# EAGLE design esp32_board (EAGLE 9.6.2)
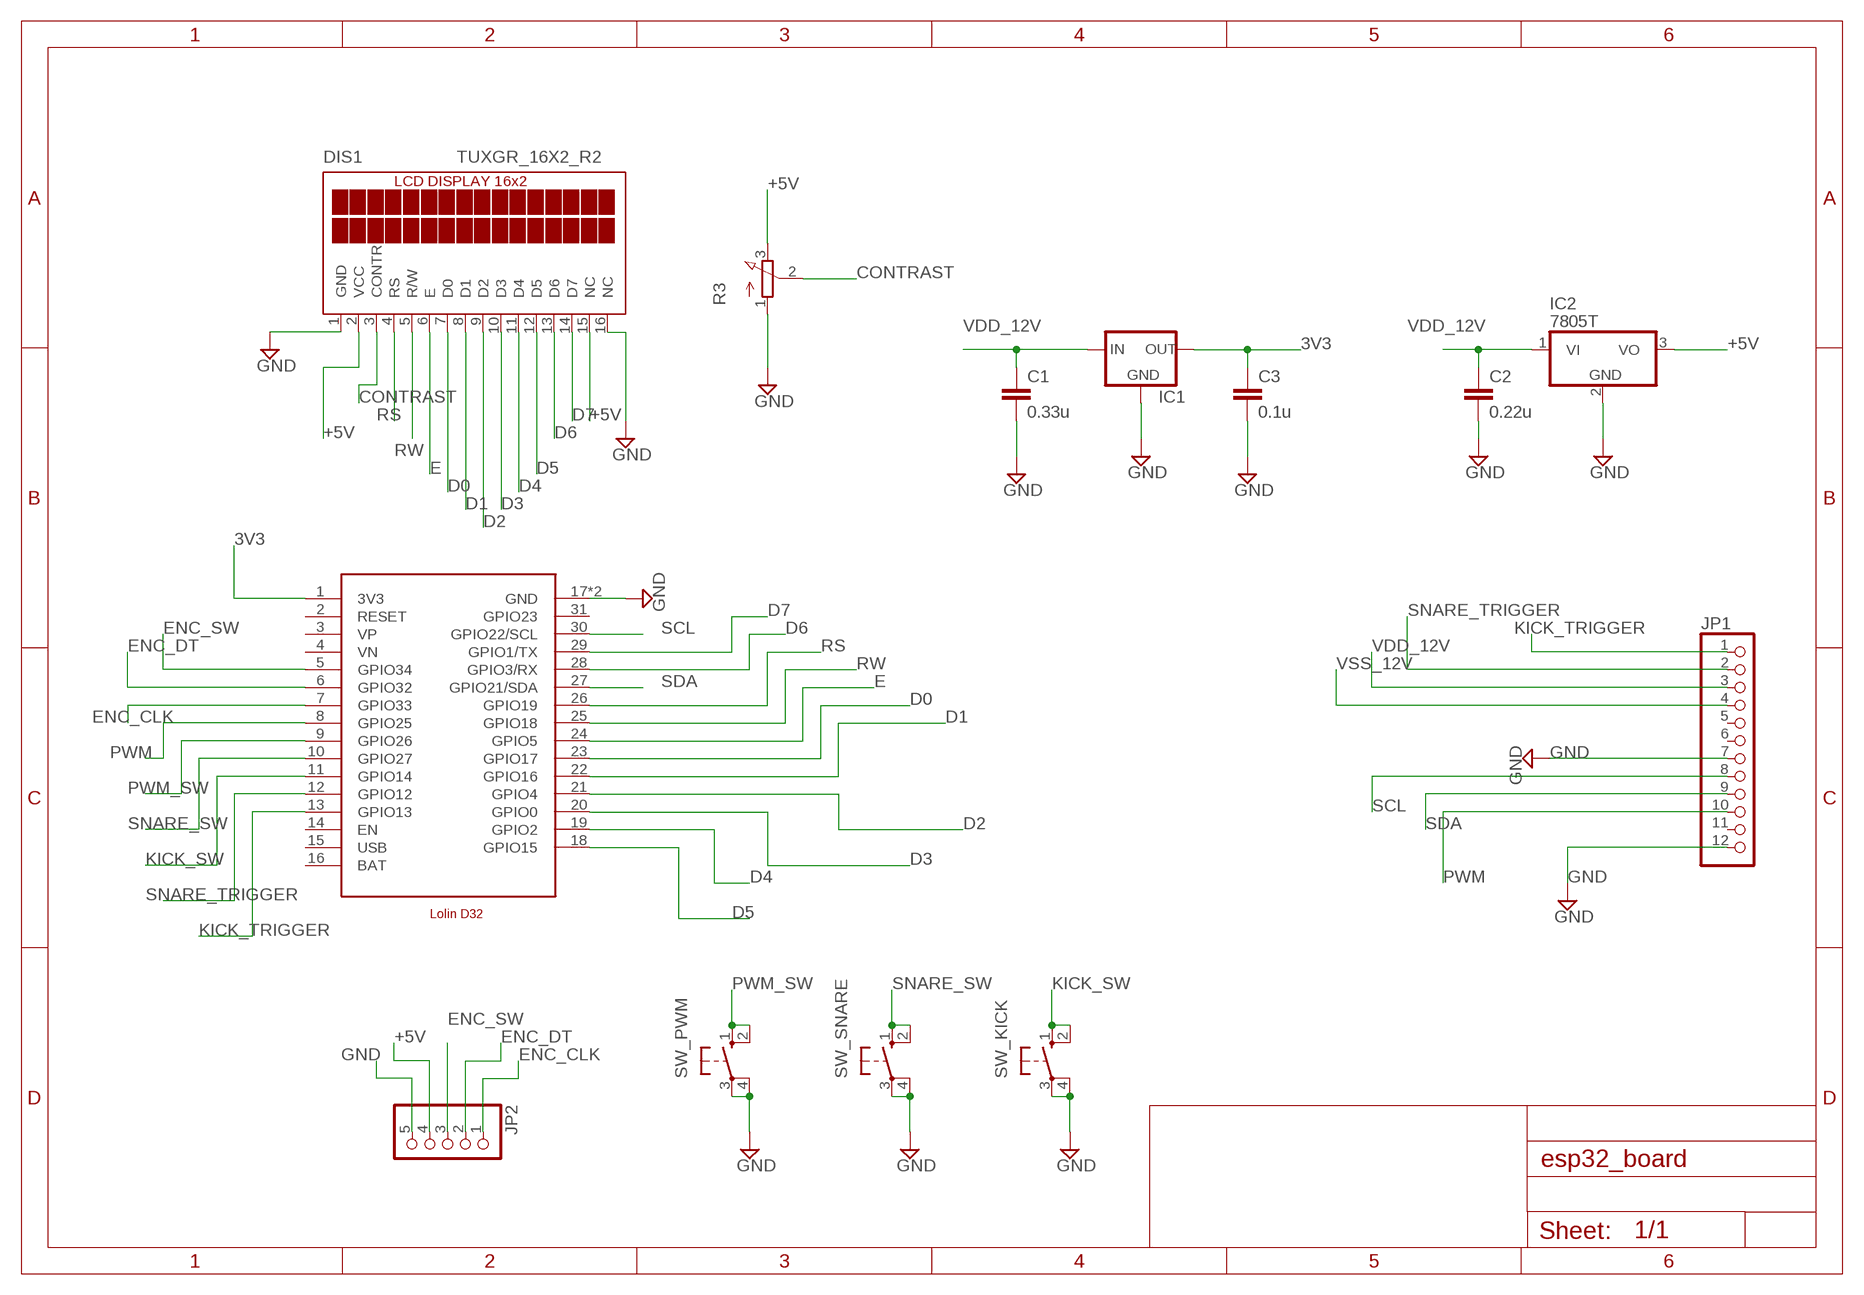
[diagram p0: schematic, sheet 1]

## Parts
C1  0.33u  C-EU025-025X050  [C025-025X050]
C2  0.22u  C-EU025-025X050  [C025-025X050]
C3  0.1u  C-EU025-025X050  [C025-025X050]
DIS1  TUXGR_16X2_R2  [TUXGR_16X2_R2]
IC1  78XXL  [78XXL]
IC2  7805T  [TO220H]
JP1  PINHD-1X12/90  [1X12/90]
JP2  PINHD-1X5  [1X05]
R3  3RP/1610N  [3RP/1610N]
SW_KICK  10-XX  [B3F-10XX]
SW_PWM  10-XX  [B3F-10XX]
SW_SNARE  10-XX  [B3F-10XX]
U$1  LOLIND32  [LOLIND32]

## Nets
3V3: C3.1 IC1.OUT U$1.1(3V3)
+5V: DIS1.2(VCC) DIS1.15(NC) IC2.3(VO) JP2.4 R3.3(E)
CONTRAST: DIS1.3(CONTR) R3.2(S)
D0: DIS1.7(D0) U$1.23(GPIO17)
D1: DIS1.8(D1) U$1.22(GPIO16)
D2: DIS1.9(D2) U$1.21(GPIO4)
D3: DIS1.10(D3) U$1.20(GPIO0)
D4: DIS1.11(D4) U$1.19(GPIO2)
D5: DIS1.12(D5) U$1.18(GPIO15)
D6: DIS1.13(D6) U$1.28(GPIO3/RX)
D7: DIS1.14(D7) U$1.29(GPIO1/TX)
E: DIS1.6(E) U$1.24(GPIO5)
ENC_CLK: JP2.1 U$1.7(GPIO33)
ENC_DT: JP2.2 U$1.6(GPIO32)
ENC_SW: JP2.3 U$1.5(GPIO34)
GND: C1.2 C2.2 C3.2 DIS1.1(GND) DIS1.16(NC) IC1.GND IC2.2(GND) JP1.7 JP1.12 JP2.5 R3.1(A) SW_KICK.3(P) SW_KICK.4(P1) SW_PWM.3(P) SW_PWM.4(P1) SW_SNARE.3(P) SW_SNARE.4(P1) U$1.17(GND) U$1.32(GND)
KICK_SW: SW_KICK.1(S) SW_KICK.2(S1) U$1.11(GPIO14)
KICK_TRIGGER: JP1.1 U$1.13(GPIO13)
PWM: JP1.10 U$1.8(GPIO25)
PWM_SW: SW_PWM.1(S) SW_PWM.2(S1) U$1.9(GPIO26)
RS: DIS1.4(RS) U$1.26(GPIO19)
RW: DIS1.5(R/W) U$1.25(GPIO18)
SCL: JP1.8 U$1.30(GPIO22/SCL)
SDA: JP1.9 U$1.27(GPIO21/SDA)
SNARE_SW: SW_SNARE.1(S) SW_SNARE.2(S1) U$1.10(GPIO27)
SNARE_TRIGGER: JP1.2 U$1.12(GPIO12)
VDD_12V: C1.1 C2.1 IC1.IN IC2.1(VI) JP1.3
VSS_12V: JP1.4
Unconnected: JP1.5 JP1.6 JP1.11 U$1.2(RESET) U$1.3(VP) U$1.4(VN) U$1.14(EN) U$1.31(GPIO23)

## Power pins joined to a net without a drawn wire
BAT: U$1.16(BAT)
USB: U$1.15(USB)

## Library data of the parts
C1-C3 = rcl:C-EU: CAPACITOR, European symbol; SPICEPREFIX: C
DIS1 = display-lcd:TUXGR_16X2_R2: Tuxgraphics LCD display 16x2 characters reflective, without background light Source: tuxgr_12x2_r2.pdf; OC_FARNELL: unknown; OC_NEWARK: unknown
IC1 = v-reg-3:78XXL: VOLTAGE REGULATOR
IC2 = linear:78*: Positive VOLTAGE REGULATOR Source: http://cache.national.com/ds/LM/LM78L05.pdf http://www.fairchildsemi.com/ds/LM/LM7805.pdf
JP1 = pinhead:PINHD-1X12: PIN HEADER
JP2 = pinhead:PINHD-1X5: PIN HEADER
R3 = pot:3RP/1610N: 16mm Potentiometer one level Source: http://www.alphapotentiometers.net/html/16mm_pot_2.html
SW_KICK SW_PWM SW_SNARE = switch-omron:10-XX: OMRON SWITCH; MPN: B3F-1000; OC_FARNELL: 176432; OC_NEWARK: 36M3542
U$1 = microcontroller:LOLIND32: Wemos Lolin D32 Lolin D32 is a development board based on ESP32. On this schematic, this board is designed with battery port. Pins VP and VN are Not Connected pins.

## Board
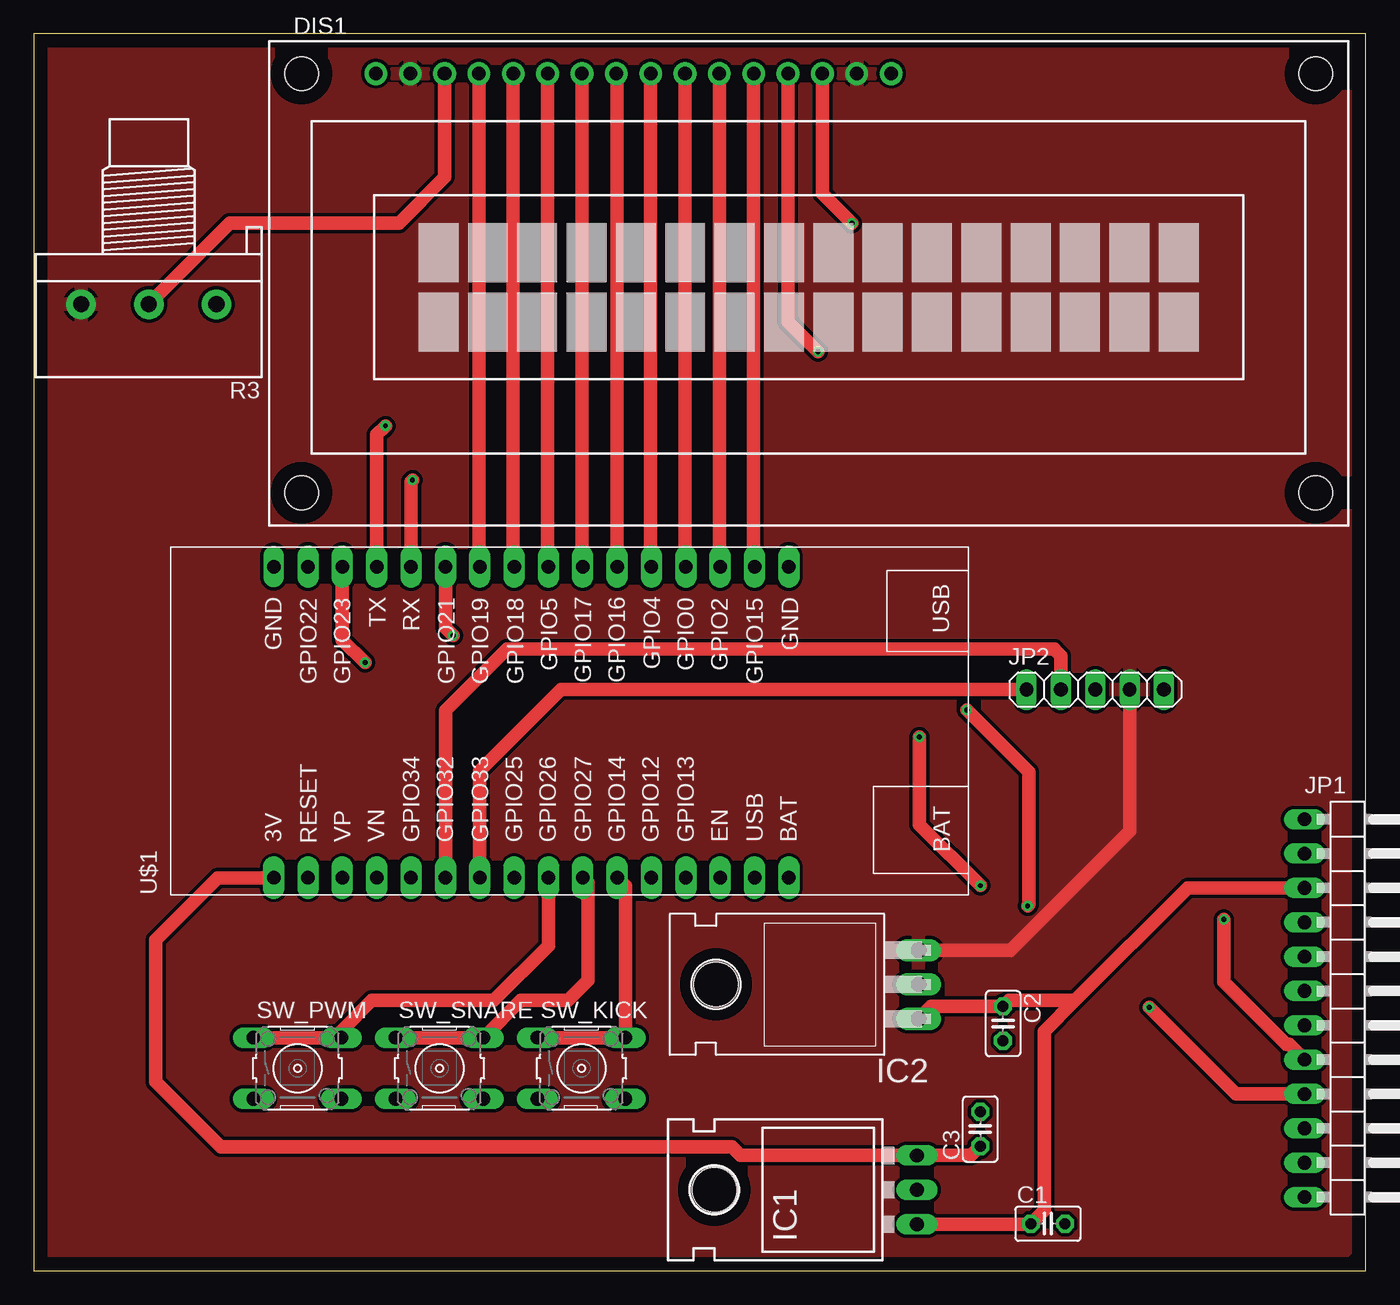
[diagram p1: board, top side]
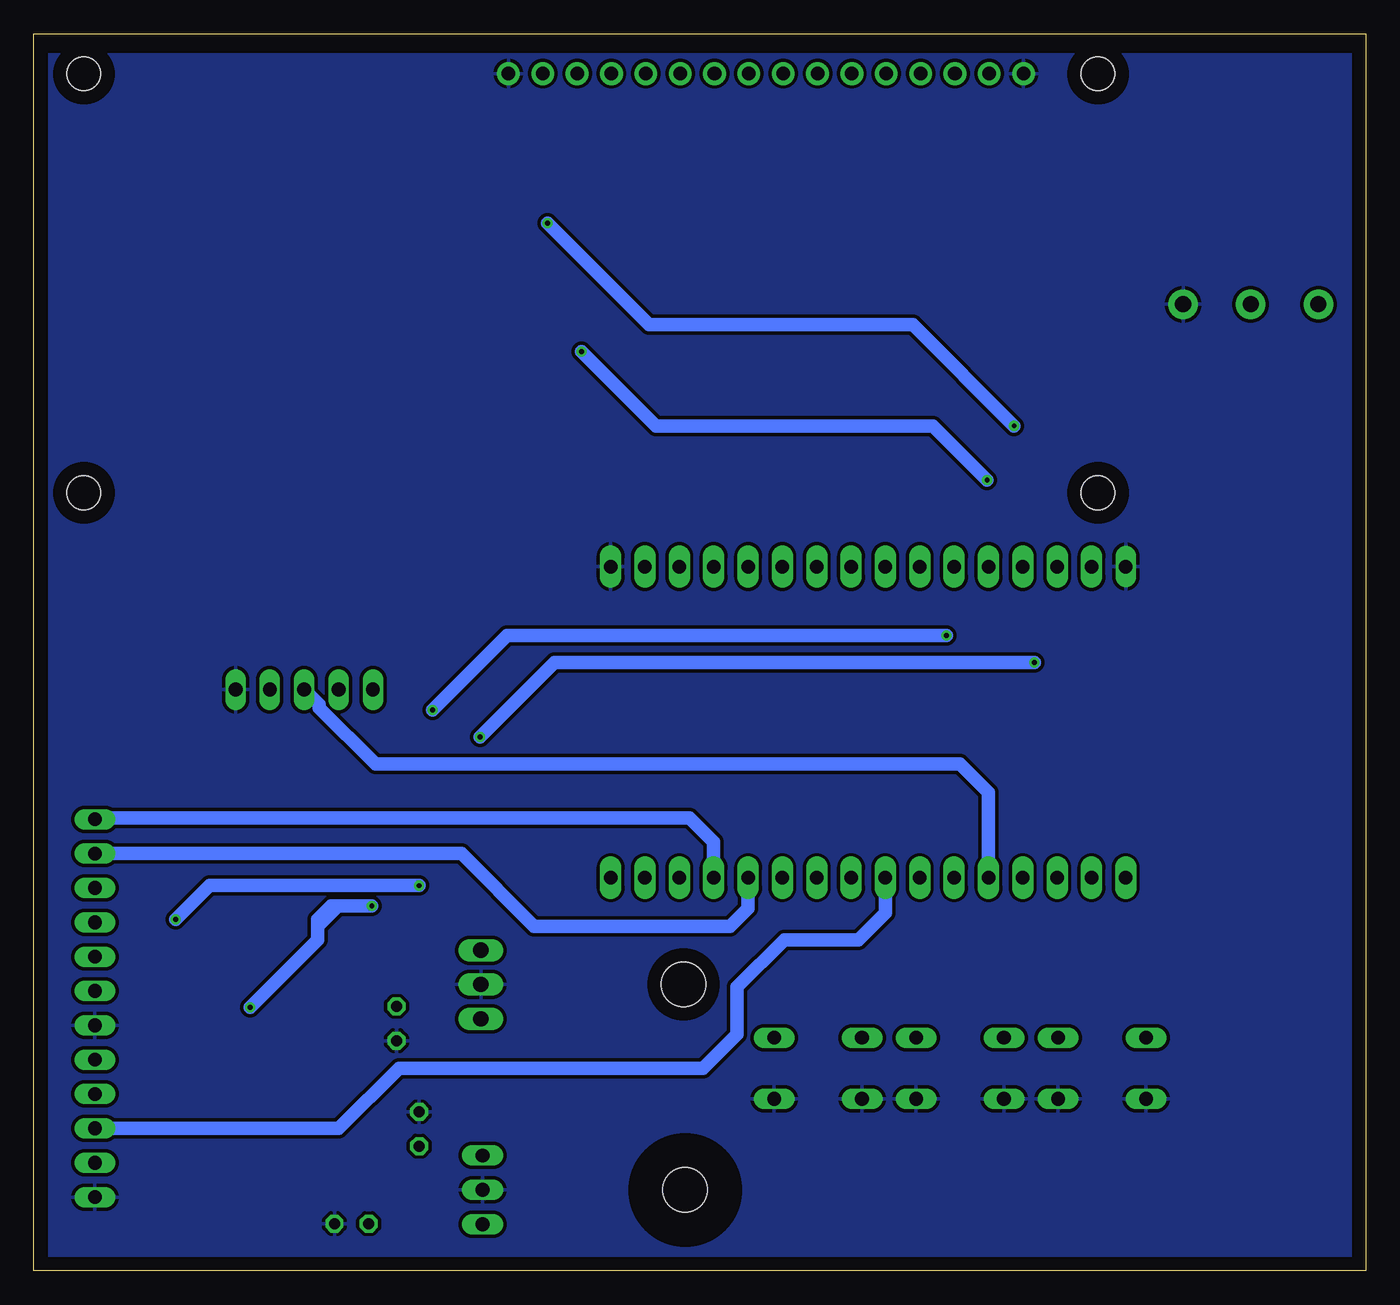
[diagram p2: board, bottom side, seen from below]

Size 98.5 x 91.5 mm. Coordinates in mm from the lower left corner, seen from the top.
Outline: 0,0 98.5,0 98.5,91.5 0,91.5 0,0
Copper layers (1*16): Top 0.035mm / dielectric 1.5mm / Bottom 0.035mm
Design rules "default *": minimum track width 6mil, minimum drill 0.35mm, track to track 10mil, track to pad 6mil, pad to pad 6mil, via to via 6mil, smd to smd 6mil, copper to edge 40mil, drill to drill 6mil, minimum pad ring 10mil, minimum via ring 8mil, stop-mask expansion 4mil, vias tented up to drill 0mil, thermal gap 10mil

### Footprints (pad centres in the part's own frame; a part is rotated, then mirrored left to right if it is on the bottom)
C025-025X050 = drill 0.813 octagon: 1 -1.27,0; 2 1.27,0
TUXGR_16X2_R2 = drill 1 pad 1.676: 1 -32,15.5; 2 -29.46,15.5; 3 -26.92,15.5; 4 -24.38,15.5; 5 -21.84,15.5; 6 -19.3,15.5; 7 -16.76,15.5; 8 -14.22,15.5; 9 -11.68,15.5; 10 -9.14,15.5; 11 -6.6,15.5; 12 -4.06,15.5; 13 -1.52,15.5; 14 1.02,15.5; 15 3.56,15.5; 16 6.1,15.5 | hole 2.5: -37.5,-15.5; 37.5,-15.5; -37.5,15.5; 37.5,15.5
78XXL = drill 1.016 long: GND 0,-3.81; IN -2.54,-3.81; OUT 2.54,-3.81 | hole 3.302: 0,11.176
TO220H = drill 1.118 long: 1 -2.54,-10.16; 2 0,-10.16; 3 2.54,-10.16 | hole 3.302: 0,4.826
1X12/90 = drill 1.016 long: 1 -13.97,-3.81; 2 -11.43,-3.81; 3 -8.89,-3.81; 4 -6.35,-3.81; 5 -3.81,-3.81; 6 -1.27,-3.81; 7 1.27,-3.81; 8 3.81,-3.81; 9 6.35,-3.81; 10 8.89,-3.81; 11 11.43,-3.81; 12 13.97,-3.81
1X05 = drill 1.016 long: 1 -5.08,0; 2 -2.54,0; 3 0,0; 4 2.54,0; 5 5.08,0
3RP/1610N = drill 1.2 pad 2.184: 1 -5,0; 2 0,0; 3 5,0
B3F-10XX = drill 1.016 long: 1 -3.251,2.261; 2 3.251,2.261; 3 -3.251,-2.261; 4 3.251,-2.261
LOLIND32 = drill 1 pad 1.575 long: 1 -11.43,21.59; 2 -11.43,19.05; 3 -11.43,16.51; 4 -11.43,13.97; 5 -11.43,11.43; 6 -11.43,8.89; 7 -11.43,6.35; 8 -11.43,3.81; 9 -11.43,1.27; 10 -11.43,-1.27; 11 -11.43,-3.81; 12 -11.43,-6.35; 13 -11.43,-8.89; 14 -11.43,-11.43; 15 -11.43,-13.97; 16 -11.43,-16.51; 17 11.58,-16.51; 18 11.58,-13.97; 19 11.58,-11.43; 20 11.58,-8.89; 21 11.58,-6.35; 22 11.58,-3.81; 23 11.58,-1.27; 24 11.58,1.27; 25 11.58,3.81; 26 11.58,6.35; 27 11.58,8.89; 28 11.58,11.43; 29 11.58,13.97; 30 11.58,16.51; 31 11.58,19.05 | drill 1 pad 1.524 long: 32 11.58,21.59

### Placement (x,y rotation side)
C1  75,3.5 0 top
C2  71.68,18.3 270 top
C3  70,10.5 90 top
DIS1  57.3,73.05 0 top
IC1  61.5,6 90 top
IC2  55.28,21.19 90 top
JP1  97.79,19.44 270 top
JP2  78.5,43 0 top
R3  8.5,71.5 180 top
SW_KICK  40.5,15 0 top
SW_PWM  19.5,15 0 top
SW_SNARE  30,15 0 top
U$1  39.33,40.52 90 top

### Tracks (layer width: path | path; a pad name or v marks a point on that pad's centre or on a via)
3V3
  Top 1.016: C3.1 69.31,8.54 IC1.OUT 52.27,8.54 51.64,9.18 13.83,9.18 9,14 9,24.5 13.59,29.09 U$1.1
+5V
  Top 1.016: IC2.3 72.23,23.73 81.04,32.54 JP2.4
  pour Top: -10.5,90.5 97.5,90.5 97.5,2 96.5,1 -10,1 -11,2 -11,90
CONTRAST
  Top 1.016: R3.2 14.5,77.5 27,77.5 30.38,80.88 DIS1.3
D0
  Top 1.016: DIS1.7 40.54,52.16 U$1.23
D1
  Top 1.016: U$1.22 43.14,88.49 DIS1.8
D2
  Top 1.016: DIS1.9 45.62,52.16 U$1.21
D3
  Top 1.016: DIS1.10 48.16,52.16 U$1.20
D4
  Top 1.016: DIS1.11 50.7,52.16 U$1.19
D5
  Top 1.016: DIS1.12 53.24,52.16 U$1.18
D6  (via drill 0.35)
  Top 1.016: U$1.28 27.9,58.4 v28,58.5 | v58,68 55.78,70.22 DIS1.13
  Bottom 1.016: v28,58.5 32,62.5 52.5,62.5 v58,68
D7  (via drill 0.35)
  Top 1.016: U$1.29 25.36,61.86 v26,62.5 | v60.5,77.5 58.32,79.68 DIS1.14
  Bottom 1.016: v26,62.5 33.5,70 53,70 v60.5,77.5
E
  Top 1.016: U$1.24 38,52.16 DIS1.6
ENC_CLK
  Top 1.016: JP2.1 39,43 32.98,36.98 U$1.7
ENC_DT
  Top 1.016: JP2.2 75.96,45.48 75.46,45.97 75.46,46 35,46 30.44,41.44 U$1.6
ENC_SW
  Bottom 1.016: JP2.3 77.38,41.88 77.38,41.65 73.23,37.5 30,37.5 27.9,35.4 U$1.5
GND
  pour Bottom: -60.5,90 98,90 98,-8 -60.5,-8
KICK_SW
  Top 1.016: SW_KICK.1 SW_KICK.2 43.75,28.48 U$1.11
KICK_TRIGGER
  Bottom 1.016: U$1.13 48.22,31.72 50,33.5 93.89,33.5 JP1.1
PWM
  Bottom 1.016: JP1.10 75.95,10.55 71.5,15 49,15 46.5,17.5 46.5,21 43,24.5 37.5,24.5 35.52,26.48 U$1.8
PWM_SW
  Top 1.016: SW_PWM.1 SW_PWM.2 22.75,17.75 25,20 34,20 38.06,24.06 U$1.9
RS
  Top 1.016: DIS1.4 32.92,52.16 U$1.26
RW
  Top 1.016: DIS1.5 35.46,52.16 U$1.25
SCL  (via drill 0.35)
  Top 1.016: U$1.30 22.82,46.68 v24.5,45 | JP1.8 92.86,16.75 92.63,16.75 88,21.38 v88,26 | v70,28.5 65.5,33 v65.5,39.5
  Bottom 1.016: v24.5,45 60,45 v65.5,39.5 | v88,26 85.5,28.5 v70,28.5
SDA  (via drill 0.35)
  Top 1.016: U$1.27 30.44,47.56 v31,47 | JP1.9 88.91,13.09 v82.5,19.5 | v69,41.5 73.6,36.9 73.6,27.1 v73.5,27
  Bottom 1.016: v31,47 63.5,47 v69,41.5 | v82.5,19.5 77.5,24.5 77.5,25.5 | 77.5,25.5 76,27 | 76,27 v73.5,27 | 77.5,25.5 77.5,26 76.5,27 76,27
SNARE_SW
  Top 1.016: SW_SNARE.1 SW_SNARE.2 35.99,20 39.5,20 41,21.5 41,28 41,28.69 U$1.10
SNARE_TRIGGER
  Bottom 1.016: U$1.12 45.68,26.82 47,25.5 61.5,25.5 66.87,30.87 JP1.2
VDD_12V
  Top 1.016: JP1.3 85.33,28.33 77,20 | 77,20 72.11,20 C2.1 66.36,19.57 IC2.1 | 77,20 74.73,17.73 74.73,4.5 C1.1 73.69,3.46 IC1.IN